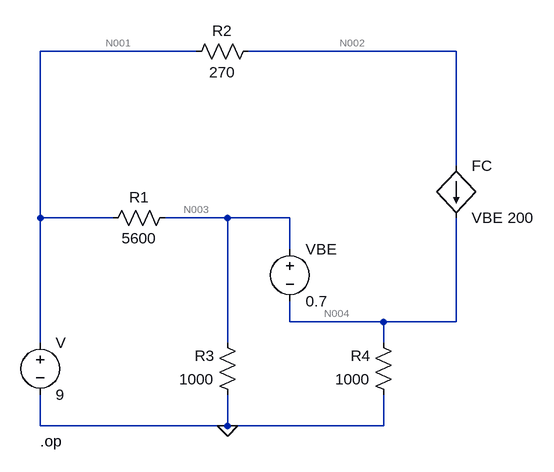
[diagram p0: schematic Circuit 4 Beta 1.asc]
Circuit 4 Beta 1.asc, the LTspice schematic file:
Version 4
SHEET 1 1428 680
WIRE 848 -160 608 -160
WIRE 1248 -160 928 -160
WIRE 1248 16 1248 -160
WIRE 608 96 608 -160
WIRE 720 96 608 96
WIRE 896 96 800 96
WIRE 992 96 896 96
WIRE 992 144 992 96
WIRE 992 256 992 224
WIRE 1136 256 992 256
WIRE 1248 256 1248 96
WIRE 1248 256 1136 256
WIRE 608 288 608 96
WIRE 896 288 896 96
WIRE 1136 288 1136 256
WIRE 608 416 608 368
WIRE 896 416 896 368
WIRE 896 416 608 416
WIRE 1136 416 1136 368
WIRE 1136 416 896 416
FLAG 896 416 0
SYMBOL res 816 80 R90
WINDOW 0 0 56 VBottom 2
WINDOW 3 32 56 VTop 2
SYMATTR InstName R1
SYMATTR Value 5600
SYMBOL res 944 -176 R90
WINDOW 0 0 56 VBottom 2
WINDOW 3 32 56 VTop 2
SYMATTR InstName R2
SYMATTR Value 270
SYMBOL res 912 384 R180
WINDOW 0 36 76 Left 2
WINDOW 3 36 40 Left 2
SYMATTR InstName R3
SYMATTR Value 1000
SYMBOL res 1152 384 R180
WINDOW 0 36 76 Left 2
WINDOW 3 36 40 Left 2
SYMATTR InstName R4
SYMATTR Value 1000
SYMBOL voltage 608 272 R0
SYMATTR InstName V
SYMATTR Value 9
SYMBOL voltage 992 128 R0
SYMATTR InstName VBE
SYMATTR Value 0.7
SYMBOL f 1248 16 R0
SYMATTR InstName FC
SYMATTR Value VBE 200
TEXT 608 440 Left 2 !.op

The netlist it stands for:
* Circuit 4 Beta 1.asc
R1 N003 N001 5600
R2 N002 N001 270
R3 0 N003 1000
R4 0 N004 1000
V N001 0 9
VBE N003 N004 0.7
FC N002 N004 VBE 200
.op
.backanno
.end

* Results of the author's LTspice run, read from the files saved beside the schematic
* Operating Point:
*   V(n003) = 1.361 V
*   V(n001) = 9 V
*   V(n002) = 8.822 V
*   V(n004) = 660.8 mV
*   I(Fc) = 657.6 µA
*   I(R1) = -1.364 mA
*   I(R2) = -657.6 µA
*   I(R3) = -1.361 mA
*   I(R4) = -660.8 µA
*   I(V) = -2.022 mA
*   I(Vbe) = 3.288 µA